# EAGLE design B200-GPSDO (EAGLE 7.4.0)
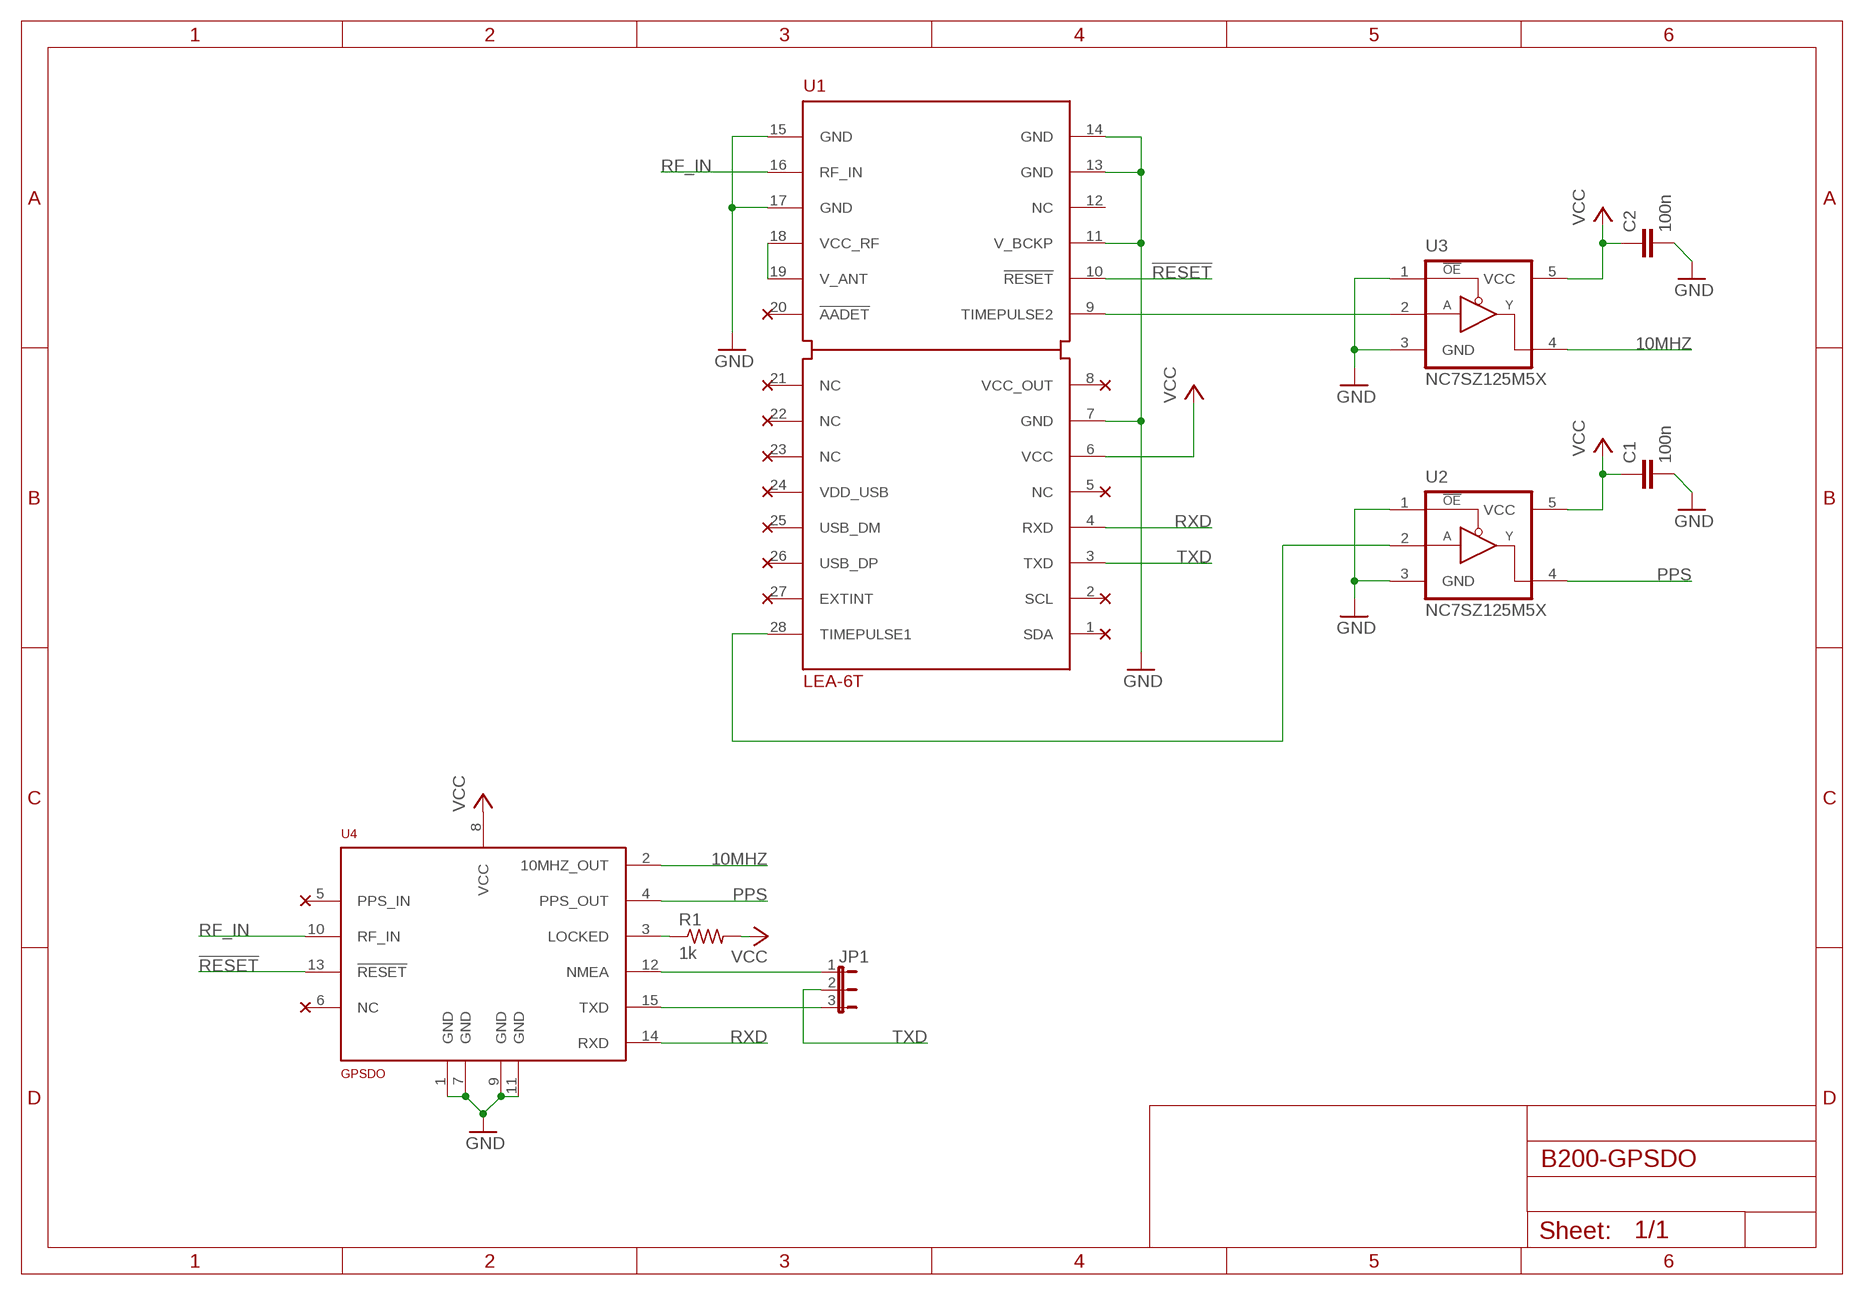
[diagram p0: schematic, sheet 1]

## Parts
C1  100n  C-EUC0805  [C0805]
C2  100n  C-EUC0805  [C0805]
JP1  JP2E  [JP2]
R1  1k  R-US_R0805  [R0805]
U1  LEA-6T  [LEA]
U2  NC7SZ125M5X  NC7SZ125  [SOT-23-5]
U3  NC7SZ125M5X  NC7SZ125  [SOT-23-5]
U4  GPSDO  [GPSDO]
U$1  NO-ERC-PAS  (no package)
U$2  NO-ERC-PAS  (no package)
U$3  NO-ERC-PAS  (no package)
U$4  NO-ERC-PAS  (no package)
U$5  NO-ERC-PAS  (no package)
U$6  NO-ERC-PAS  (no package)
U$7  NO-ERC-PAS  (no package)
U$8  NO-ERC-PAS  (no package)
U$15  NO-ERC-PAS  (no package)

## Nets
10MHZ: U3.4(Y) U4.2(10MHZ_OUT)
!RESET: U1.10(!RESET) U4.13(!RESET)
GND: C1.2 C2.2 U1.7(GND) U1.11(V_BCKP) U1.13(GND) U1.14(GND) U1.15(GND) U1.17(GND) U2.1(OE#) U2.3(GND) U3.1(OE#) U3.3(GND) U4.1(GND) U4.7(GND) U4.9(GND) U4.11(GND)
N$1: U1.18(VCC_RF) U1.19(V_ANT)
N$2: U1.20(!AADET) U$1.0
N$3: U1.9(TIMEPULSE2) U3.2(A)
N$4: U1.28(TIMEPULSE1) U2.2(A)
N$5: U4.5(PPS_IN) U$15.0
N$7: R1.1 U4.3(LOCKED)
N$8: JP1.1 U4.12(NMEA)
N$9: JP1.3 U4.15(TXD)
N$10: U1.25(USB_DM) U$2.0
N$11: U1.26(USB_DP) U$3.0
N$12: U1.27(EXTINT) U$4.0
N$13: U1.1(SDA) U$6.0
N$14: U1.2(SCL) U$7.0
N$15: U1.8(VCC_OUT) U$8.0
N$17: U1.24(VDD_USB) U$5.0
PPS: U2.4(Y) U4.4(PPS_OUT)
RF_IN: U1.16(RF_IN) U4.10(RF_IN)
RXD: U1.4(RXD) U4.14(RXD)
TXD: JP1.2 U1.3(TXD)
VCC: C1.1 C2.1 R1.2 U1.6(VCC) U2.5(VCC) U3.5(VCC) U4.8(VCC)
Unconnected: U1.5(NC) U1.12(NC) U1.21(NC) U1.22(NC) U1.23(NC) U4.6(NC)

## Library data of the parts
C1 C2 = rcl:C-EU: CAPACITOR, European symbol
JP1 = jumper:JP2E: JUMPER
R1 = rcl:R-US_: RESISTOR, American symbol
U1 = B200-GPSDO:LEA-6T
U2 U3 = B200-GPSDO:NC7SZ125
U4 = B200-GPSDO:GPSDO
U$1-U$8 U$15 = B200-GPSDO:NO-ERC-PAS

## Board
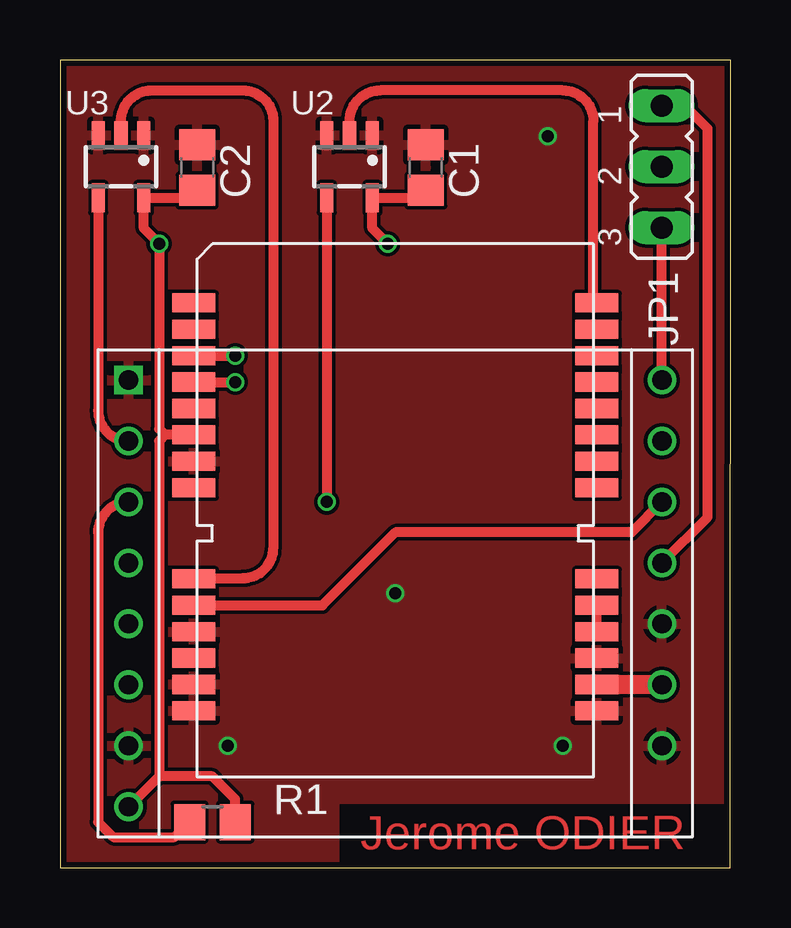
[diagram p1: board, top side]
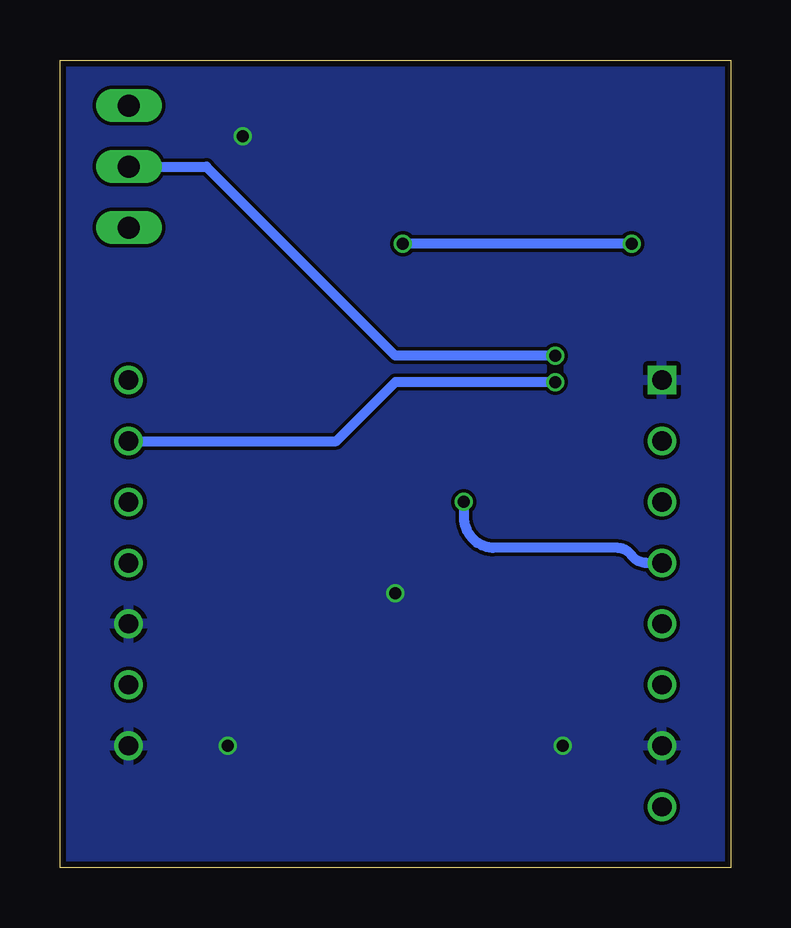
[diagram p2: board, bottom side, seen from below]

Size 27.94 x 33.66 mm. Coordinates in mm from the lower left corner, seen from the top.
Outline: 0,0 27.92,0 27.94,33.66 0,33.66 0,0
Copper layers (1*16): Top 0.018mm / dielectric 1.55mm / Bottom 0.018mm
Design rules "eC_2Layer_PClass6_BaseCopperO18_eCDefault": minimum track width 0.15mm, minimum drill 0.35mm, track to track 0.15mm, track to pad 0.15mm, pad to pad 0.15mm, via to via 0.15mm, smd to smd 0mil, copper to edge 0.25mm, drill to drill 0.35mm, minimum pad ring 0.175mm, minimum via ring 0.125mm, stop-mask expansion 0mil, vias tented up to drill 0.45mm, thermal gap 0.2mm

### Footprints (pad centres in the part's own frame; a part is rotated, then mirrored left to right if it is on the bottom)
C0805 = smd 1.3 x 1.5: 1 -0.95,0; 2 0.95,0
JP2 = drill 0.914 long: 1 -2.54,0; 2 0,0; 3 2.54,0
R0805 = smd 1.3 x 1.5: 1 -0.95,0; 2 0.95,0
LEA = smd 1.8 x 0.8: 1 8.4,-8.65; 2 8.4,-7.55; 3 8.4,-6.45; 4 8.4,-5.35; 5 8.4,-4.25; 6 8.4,-3.15; 7 8.4,-2.05; 8 8.4,-0.95; 9 8.4,2.85; 10 8.4,3.95; 11 8.4,5.05; 12 8.4,6.15; 13 8.4,7.25; 14 8.4,8.35; 15 -8.4,8.35; 16 -8.4,7.25; 17 -8.4,6.15; 18 -8.4,5.05; 19 -8.4,3.95; 20 -8.4,2.85; 21 -8.4,-0.95; 22 -8.4,-2.05; 23 -8.4,-3.15; 24 -8.4,-4.25; 25 -8.4,-5.35; 26 -8.4,-6.45; 27 -8.4,-7.55; 28 -8.4,-8.65
SOT-23-5 = smd 0.55 x 1.2: 1 -0.95,-1.3; 2 0,-1.3; 3 0.95,-1.3; 4 0.95,1.3; 5 -0.95,1.3
GPSDO = drill 0.8 square: 1 -11.113,8.89 | drill 0.8: 2 -11.113,6.35; 3 -11.113,3.81; 4 -11.113,1.27; 5 -11.113,-1.27; 6 -11.113,-3.81; 7 -11.113,-6.35; 8 -11.113,-8.89; 9 11.113,-6.35; 10 11.113,-3.81; 11 11.113,-1.27; 12 11.113,1.27; 13 11.113,3.81; 14 11.113,6.35; 15 11.113,8.89

### Placement (x,y rotation side)
C1  15.24,29.17 90 top
C2  5.71,29.17 90 top
JP1  25.07,29.21 270 top
R1  6.35,1.91 0 top
U1  13.97,14.88 180 top
U2  12.06,29.21 180 top
U3  2.54,29.21 180 top
U4  13.97,11.43 0 top

### Tracks (layer width: path | path; a pad name or v marks a point on that pad's centre or on a via)
10MHZ
  Top 0.406: U3.4 1.59,19.05 arc90 U4.2
!RESET
  Top 0.406: U4.13 23.81,13.97 13.97,13.97 10.93,10.93 U1.10
GND  (via drill 0.5)
  other vias: 20.32,30.48 6.99,5.08 20.95,5.08 13.97,11.43
  pour Bottom: 0,33.66 27.94,33.66 27.94,0 0,0
  pour Top: 0,33.66 27.94,33.66 27.94,2.86 11.43,2.86 11.43,0 0,0
N$1
  Top 0.406: U1.18 U1.19
N$3
  Top 0.406: U1.9 5.6,12.06 7.62,12.06 arc90 8.89,13.34 8.89,31.11 arc90 7.62,32.38 3.81,32.38 arc90 2.54,31.11 U3.2
N$4
  Top 0.406: U2.2 12.06,31.11 arc-90 13.34,32.38 20.95,32.38 arc-90 22.23,31.11 22.23,23.68 U1.28
N$7
  Top 0.406: U4.3 arc90 1.59,13.97 1.59,1.91 2.22,1.27 4.76,1.27 R1.1
N$8
  Top 0.406: U4.12 26.99,14.61 26.99,30.8 26.04,31.75 JP1.1
N$9
  Top 0.406: U4.15 JP1.3
PPS  (via drill 0.5)
  Top 0.406: U2.4 v11.11,15.24
  Bottom 0.406: U4.4 3.49,12.7 arc53 4.13,13.02 arc-53 4.76,13.34 9.84,13.34 arc90 11.11,14.61 v11.11,15.24
RF_IN
  Top 0.406: 25.08,7.63 U4.10
  Top 0.787: U1.16 25.08,7.63
RXD  (via drill 0.5)
  Top 0.406: U1.4 v7.3,20.23
  Bottom 0.406: v7.3,20.23 13.97,20.23 16.42,17.78 U4.14
TXD  (via drill 0.5)
  Top 0.406: U1.3 v7.3,21.33
  Bottom 0.406: v7.3,21.33 13.97,21.33 21.85,29.21 JP1.2
VCC  (via drill 0.5)
  Top 0.406: U1.6 4.38,18.03 | 14.93,27.9 C1.1 14.93,27.91 U2.5 13.02,26.63 v13.65,26 | 4.38,18.03 4.13,18.29 v4.13,26 3.49,26.63 U3.5 5.4,27.91 C2.1 | 4.38,18.03 4.13,17.78 4.13,3.81 | 4.13,3.81 U4.8 | R1.2 7.3,2.86 6.35,3.81 4.13,3.81
  Bottom 0.406: v4.13,26 v13.65,26

### Text on the board
Top: Jerome ODIER